# Altium project Simple.PrjPcb
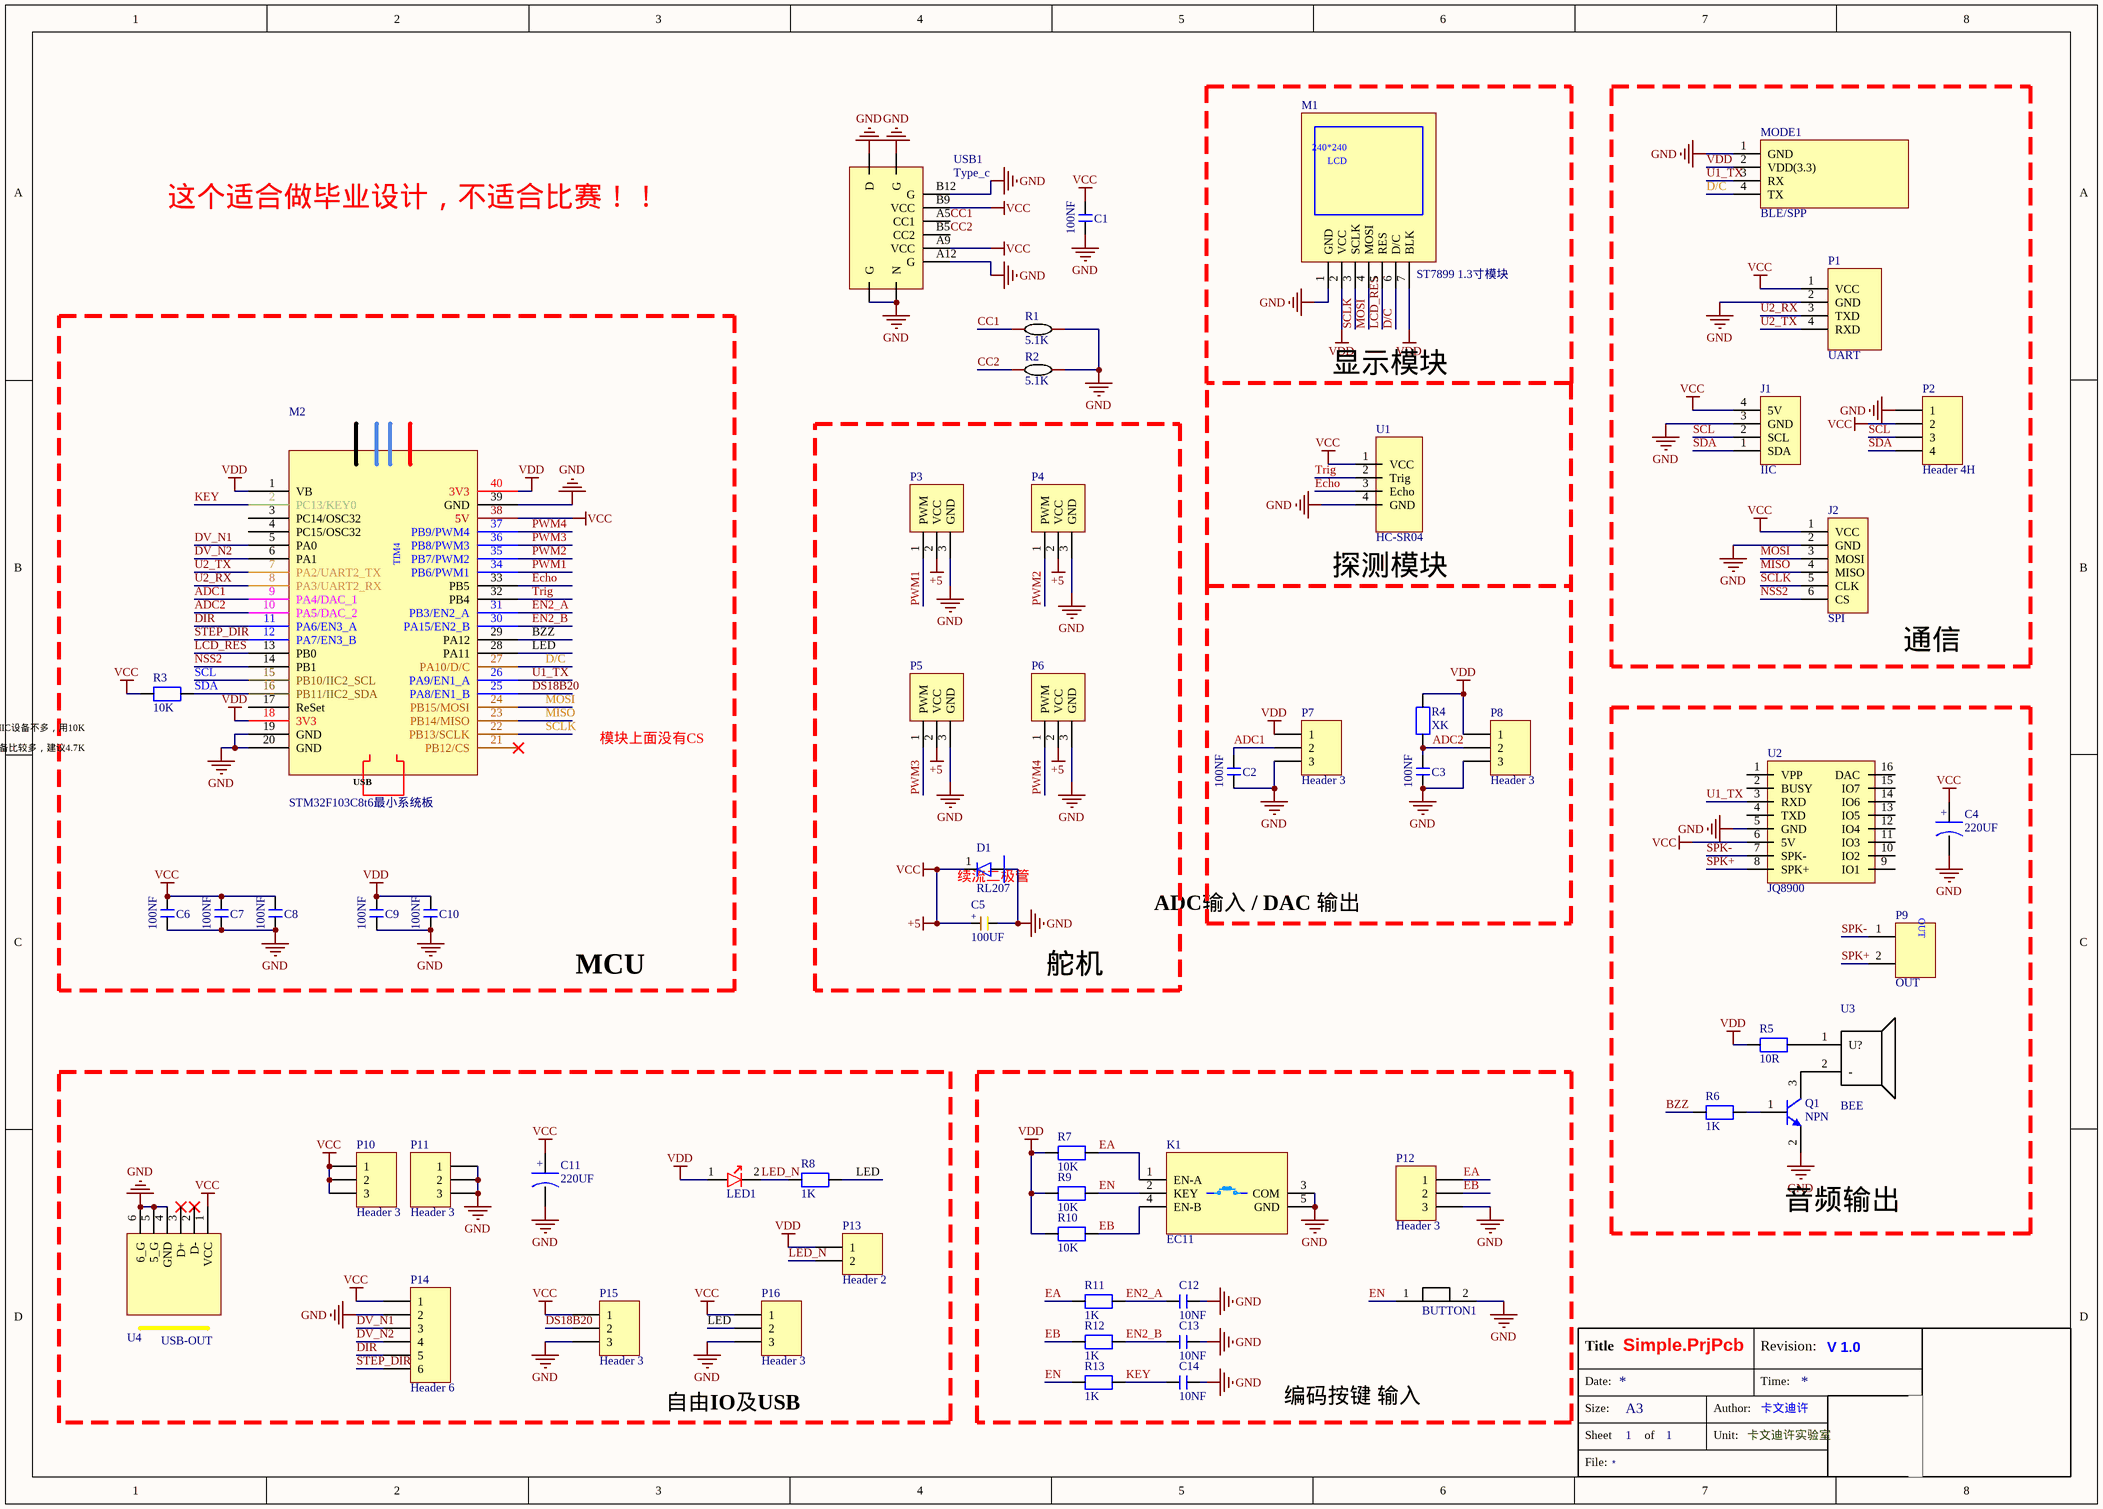
[diagram p0: Sheet.SchDoc]
1 sheet, 58 parts. Net scope: global (net labels, ports and power ports of the same name join across sheets).
Board file: PCB.PcbDoc

## Sheet Sheet.SchDoc
size A3; Author: 卡文迪许; CompanyName: 卡文迪许实验室; Revision: V 1.0; SheetNumber: 1; SheetTotal: 1

### Parts
BUTTON1  BUTTON  [KEY-A]  (value not drawn)
C1  100NF  [CAP_0603]
C2  100NF  [CAP_0603]
C3  100NF  [CAP_0603]
C4  220UF  [CAP_PR_2.5_6.3_RA]
C5  100UF  [CAP_3528_B]
C6  100NF  [CAP_0603]
C7  100NF  [CAP_0603]
C8  100NF  [CAP_0603]
C9  100NF  [CAP_0603]
C10  100NF  [CAP_0603]
C11  220UF  [CAP_PR_2.5_8]
C12  10NF  [CAP_0603]
C13  10NF  [CAP_0603]
C14  10NF  [CAP_0603]
D1  RL207  [Diode_DO15]
J1  IIC  [XH2.54-WI-4P]
J2  SPI  [Header 2.54X6]
K1  EC11  [EC-11]
LED1  LED_R/G/B/Y  [LED_5MM]  (value not drawn)
M1  ST7899 1.3寸模块  [LCD-1.3_mode]
M2  STM32F103C8t6最小系统板  [STM32F103C8_mode]
MODE1  BLE/SPP  [Header 2.54X4]
P1  UART  [XH2.54-WI-4P]
P2  Header 4H  [Header 2.54X4]
P3  Header3  [Header 2.54X3]  (value not drawn)
P4  Header3  [Header 2.54X3]  (value not drawn)
P5  Header3  [Header 2.54X3]  (value not drawn)
P6  Header3  [Header 2.54X3]  (value not drawn)
P7  Header 3  [Header 2.54X3]
P8  Header 3  [Header 2.54X3]
P9  OUT  [XH2.54-WI-2P]
P10  Header 3  [Header 2.54X3]
P11  Header 3  [Header 2.54X3]
P12  Header 3  [Header 2.54X3]
P13  Header 2  [HDR1X2]
P14  Header 6  [HDR1X6]
P15  Header 3  [XH2.54-WI-3P]
P16  Header 3  [XH2.54-WI-3P]
Q1  NPN  [SOT23_3]
R1  5.1K  [RESC_0603_1]
R2  5.1K  [RESC_0603_1]
R3  10K  [RES_0.4_1/4W]
R4  XK  [RES_0.4_1/4W]
R5  10R  [RES_0.4_1/4W]
R6  1K  [RES_0.4_1/4W]
R7  10K  [RES_0.4_1/4W]
R8  1K  [RES_0.4_1/4W]
R9  10K  [RES_0.4_1/4W]
R10  10K  [RES_0.4_1/4W]
R11  1K  [RES_0.4_1/4W]
R12  1K  [RES_0.4_1/4W]
R13  1K  [RES_0.4_1/4W]
U1  HC-SR04  [XH2.54-WI-4P]
U2  JQ8900  [SpkMo]
U3  BEE  [BEE-FMQ5mm]
U4  USB-OUT  [USB_BA]
USB1  Type_c  [USB-TYPE_6P]

### Blocks framed on the sheet
显示模块: M1
通信: J1 J2 MODE1 P1 P2
MCU: C6-C10 M2 R3
舵机: C5 D1 P3-P6
音频输出: C4 P9 Q1 R5 R6 U2 U3
自由IO及USB: C11 LED1 P10 P11 P13-P16 R8 U4
编码按键 输入: BUTTON1 C12-C14 K1 P12 R7 R9-R13

### Nets
+5: C1.2 C4.1 C5.1 C6.2 C7.2 C8.2 C11.1 D1.1(N) J1.4(5V) J2.1(VCC) M2.38(5V) P1.1(VCC) P2.2 P3.2(VCC) P4.2(VCC) P5.2(VCC) P6.2(VCC) P10.1 P10.2 P10.3 P14.1 P15.1 P16.1 R3.1 U1.1(VCC) U2.6(5V) U4.1(VCC) USB1.A9(VCC) USB1.B9(VCC)  [also labelled VCC]
GND: BUTTON1.2 C1.1 C2.1 C3.1 C4.2 C5.2 C6.1 C7.1 C8.1 C9.1 C10.1 C11.2 C12.1 C13.1 C14.1 D1.2(P) J1.3(GND) J2.2(GND) K1.3(COM) K1.5(GND) M1.1(GND) M2.19(GND) M2.20(GND) M2.39(GND) MODE1.1(GND) P1.2(GND) P2.1 P3.3(GND) P4.3(GND) P5.3(GND) P6.3(GND) P7.3 P8.3 P11.1 P11.2 P11.3 P12.3 P14.2 P15.3 P16.3 Q1.2(E) R1.2 R2.2 U1.4(GND) U2.5(GND) U4.4(GND) U4.5(5_G) U4.6(6_G) USB1.A(G) USB1.A12(G) USB1.B(N) USB1.B12(G) USB1.C(D) USB1.D(G)
VDD: C9.2 C10.2 LED1.1(+) M1.2(VCC) M1.7(BLK) M2.1(VB) M2.18(3V3) M2.40(3V3) MODE1.2(VDD(3.3)) P7.1 P8.1 P13.1 R4.2 R5.1 R7.1 R9.1 R10.1
ADC1: C2.2 M2.9(PA4/DAC_1) P7.2
ADC2: C3.2 M2.10(PA5/DAC_2) P8.2 R4.1
BZZ: M2.29(PA12) R6.1
CC1: R1.1 USB1.A5(CC1)
CC2: R2.1 USB1.B5(CC2)
D/C: M1.6(D/C) M2.27(PA10/D/C) MODE1.4(TX)
DIR: M2.11(PA6/EN3_A) P14.5
DS18B20: M2.25(PA8/EN1_B) P15.2
DV_N1: M2.5(PA0) P14.3
DV_N2: M2.6(PA1) P14.4
EA: K1.1(EN-A) P12.1 R7.2 R11.1
EB: K1.4(EN-B) P12.2 R10.2 R12.1
Echo: M2.33(PB5) U1.3(Echo)
EN: BUTTON1.1 K1.2(KEY) R9.2 R13.1
EN2_A: C12.2 M2.31(PB3/EN2_A) R11.2
EN2_B: C13.2 M2.30(PA15/EN2_B) R12.2
KEY: C14.2 M2.2(PC13/KEY0) R13.2
LCD_RES: M1.5(RES) M2.13(PB0)
LED: M2.28(PA11) P16.2 R8.2
LED_N: LED1.2(-) P13.2 R8.1
MISO: J2.4(MISO) M2.23(PB14/MISO)
MOSI: J2.3(MOSI) M1.4(MOSI) M2.24(PB15/MOSI)
NSS2: J2.6(CS) M2.14(PB1)
PWM1: M2.34(PB6/PWM1) P3.1(PWM)
PWM2: M2.35(PB7/PWM2) P4.1(PWM)
PWM3: M2.36(PB8/PWM3) P5.1(PWM)
PWM4: M2.37(PB9/PWM4) P6.1(PWM)
SCL: J1.2(SCL) M2.15(PB10/IIC2_SCL) P2.3
SCLK: J2.5(CLK) M1.3(SCLK) M2.22(PB13/SCLK)
SDA: J1.1(SDA) M2.16(PB11/IIC2_SDA) P2.4 R3.2
SPK+: P9.2 U2.8(SPK+)
SPK-: P9.1 U2.7(SPK-)
STEP_DIR: M2.12(PA7/EN3_B) P14.6
Trig: M2.32(PB4) U1.2(Trig)
U1_TX: M2.26(PA9/EN1_A) MODE1.3(RX) U2.3(RXD)
U2_RX: M2.8(PA3/UART2_RX) P1.3(TXD)
U2_TX: M2.7(PA2/UART2_TX) P1.4(RXD)
NetQ1_1: Q1.1(B) R6.2
NetQ1_3: Q1.3(C) U3.2(-)
NetR5_2: R5.2 U3.1(U?)

Not connected (* = marked no-connect by the designer): M2 3(PC14/OSC32) 4(PC15/OSC32) 17(ReSet) 21(PB12/CS)*; U2 1(VPP) 2(BUSY) 4(TXD) 9(IO1) 10(IO2) 11(IO3) 12(IO4) 13(IO5) 14(IO6) 15(IO7) 16(DAC); U4 2(D-)* 3(D+)*

### Notes on the sheet
- 这个适合做毕业设计，不适合比赛！！
- 探测模块
- (near R3) 这里IIC设备不多，用10K
- (near R3) 如果设备比较多，建议4.7K
- 模块上面没有CS
- 续流二极管
- ADC输入 / DAC 输出
- Title
- Date:
- Revision:
- Time:
- Size:
- Sheet
- A3
- of
- Author:
- Unit:
- File:
- (in symbol CAP_BIG) +
- (in symbol CAP_TA) +
- (in symbol LCD_TFT_1.3_MODE) 240*240; LCD
- (in symbol STM32F103C8_mode) TIM4; USB

### Library data of the parts
C1-C3 C6-C10 C12-C14 = CAP: CAP  12~50V
C4 C11 = CAP_BIG: CAP 12V ~ 50V   电解电容
C5 = CAP_TA: CAP  6~12V  钽电容
D1 = Diode-DO: Diode_肖特基/二极管 / 直插
J1 = IIC: MLX90614 GY-906-BCC
J2 = SPI: Heard
K1 = EN-CODE: KEY
LED1 = LED
M1 = LCD_TFT_1.3_MODE: SHOW
M2 = STM32F103C8_mode
MODE1 = JDY-34: BLE4.2
P1 = UART: Header XH2.54 弯针座 4PIN
P2 = Header 4H: Header, 4-Pin, Right Angle; LatestRevisionDate: 17-Jul-2002; LatestRevisionNote: Re-released for DXP Platform.; Publisher: Altium Limited
P3-P6 = PWM_D: Header
P7 P8 P10-P12 P15 P16 = Header 3: Header, 3-Pin; LatestRevisionDate: 17-Jul-2002; LatestRevisionNote: Re-released for DXP Platform.; Publisher: Altium Limited
P9 = OUT_2PIN: Header
P13 = Header 2: Header, 2-Pin; LatestRevisionDate: 17-Jul-2002; LatestRevisionNote: Re-released for DXP Platform.; Publisher: Altium Limited
P14 = Header 6: Header, 6-Pin; LatestRevisionDate: 17-Jul-2002; LatestRevisionNote: Re-released for DXP Platform.; Publisher: Altium Limited
Q1 = Triode-NPN
R1 R2 = RES: Symbol: 电阻; Device: Res_0603; Convert to PCB: yes; Add into BOM: yes; Supplier Footprint: 0603
R3-R13 = RES_S: RES 贴片
U1 = Ultrasonic: Mode
U2 = SPKMO_8900: MODE
U3 = BZZ
U4 = USB-OUT: USB
USB1 = USB-Type_c-6PIn: USB